# EAGLE design controller (EAGLE 7.4.0)
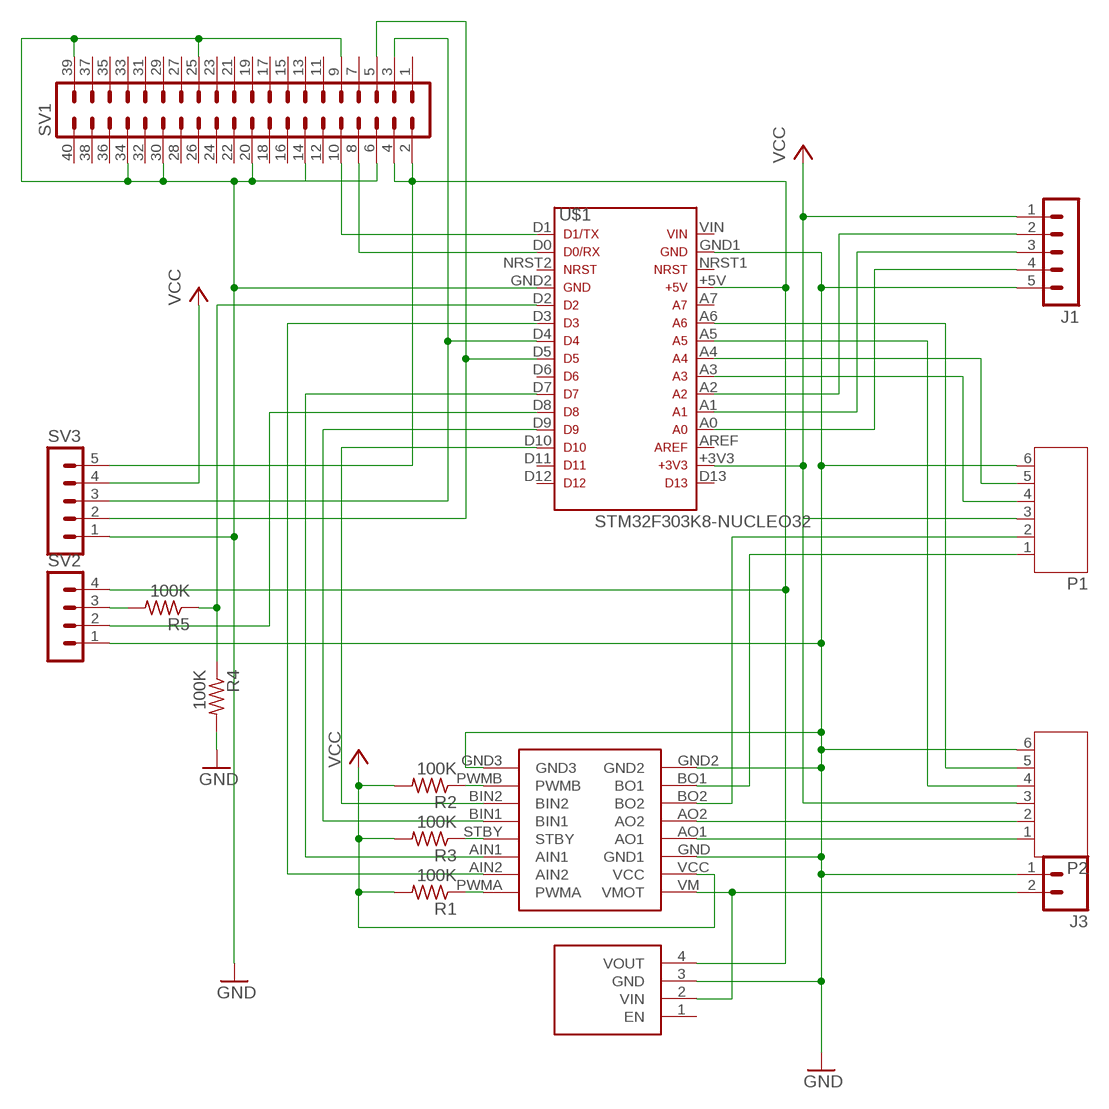
[diagram p0: schematic, sheet 1]

## Parts
J1  MA05-1  [MA05-1]
J3  M02JST-PTH-VERT  [JST-2-PTH-VERT]
P1  JST-PH6  [JST-PH6]
P2  JST-PH6  [JST-PH6]
R1  100K  R-US_M0805  [M0805]
R2  100K  R-US_M0805  [M0805]
R3  100K  R-US_M0805  [M0805]
R4  100K  R-US_M0805  [M0805]
R5  100K  R-US_M0805  [M0805]
SV1  MA20-2  [MA20-2]
SV2  MA04-1  [MA04-1]
SV3  MA05-1  [MA05-1]
U$1  STM32F303K8-NUCLEO32  [NUCLEO32]
U$2  TB6612FNG-CARRIER/SPARKFUN  [TB6612FNG-BRKOUT/SPARKFUN]
U$3  S7V8A  [S7V8]

## Nets
GND: J1.5 J3.1 P1.6 P2.6 R4.2 SV1.6 SV1.9 SV1.14 SV1.20 SV1.25 SV1.30 SV1.34 SV1.39 SV2.1 SV3.1 U$1.GND1 U$1.GND2 U$2.GND2 U$2.GND3 U$2.GND(GND1) U$3.3(GND)
N$1: U$1.D3 U$2.AIN2
N$2: U$1.D7 U$2.AIN1
N$3: U$1.D9 U$2.BIN1
N$4: U$1.D10 U$2.BIN2
N$5: P2.1 U$2.AO1
N$6: R2.1 U$2.PWMB
N$7: R1.1 U$2.PWMA
N$8: R3.1 U$2.STBY
N$9: P2.2 U$2.AO2
N$10: P1.2 U$2.BO2
N$11: P1.1 U$2.BO1
N$12: SV1.3 SV3.3 U$1.D4
N$13: SV1.5 SV3.2 U$1.D5
N$14: SV1.8 U$1.D0
N$15: SV1.10 U$1.D1
N$16: J3.2 U$2.VM(VMOT) U$3.2(VIN)
N$17: P1.5 U$1.A4
N$18: P1.4 U$1.A3
N$19: P2.5 U$1.A6
N$20: P2.4 U$1.A5
N$21: J1.2 U$1.A2
N$22: J1.3 U$1.A1
N$23: J1.4 U$1.A0
N$24: R5.2 SV2.3
N$25: SV1.2 SV1.4 SV2.4 SV3.5 U$1.+5V U$3.4(VOUT)
N$26: R4.1 R5.1 U$1.D2
N$27: SV2.2 U$1.D8
VCC: J1.1 P1.3 P2.3 R1.2 R2.2 R3.2 SV3.4 U$1.+3V3 U$2.VCC
Unconnected: SV1.1 SV1.7 SV1.11 SV1.12 SV1.13 SV1.15 SV1.16 SV1.17 SV1.18 SV1.19 SV1.21 SV1.22 SV1.23 SV1.24 SV1.26 SV1.27 SV1.28 SV1.29 SV1.31 SV1.32 SV1.33 SV1.35 SV1.36 SV1.37 SV1.38 SV1.40 U$1.A7 U$1.AREF U$1.D6 U$1.D11 U$1.D12 U$1.D13 U$1.NRST1 U$1.NRST2 U$1.VIN U$3.1(EN)

## Library data of the parts
J1 SV3 = con-lstb:MA05-1: PIN HEADER; OC_FARNELL: unknown; OC_NEWARK: unknown
J3 = SparkFun-Connectors:M02: Standard 2-pin 0.1" header. Use with - straight break away headers ( PRT-00116) - right angle break away headers (PRT-00553) - swiss pins (PRT-00743) - machine pins (PRT-00117) - female headers (PRT-00115) Molex polarized connector foot print use with: PRT-08233 with associated crimp pins and housings. 2.54_SCREWTERM for use with PRT-10571. 3.5mm Screw Terminal footprints for PRT-08084 5mm Screw Terminal footprints for use with PRT-08432
P1 P2 = jst-ph:JST-PH6
R1-R5 = adafruit:R-US_: RESISTOR, American symbol
SV1 = con-lstb:MA20-2: PIN HEADER; OC_FARNELL: unknown; OC_NEWARK: unknown
SV2 = con-lstb:MA04-1: PIN HEADER; OC_FARNELL: unknown; OC_NEWARK: unknown
U$1 = assorted:STM32F303K8-NUCLEO32
U$2 = assorted:TB6612FNG-CARRIER
U$3 = assorted:S7V8A

## Board
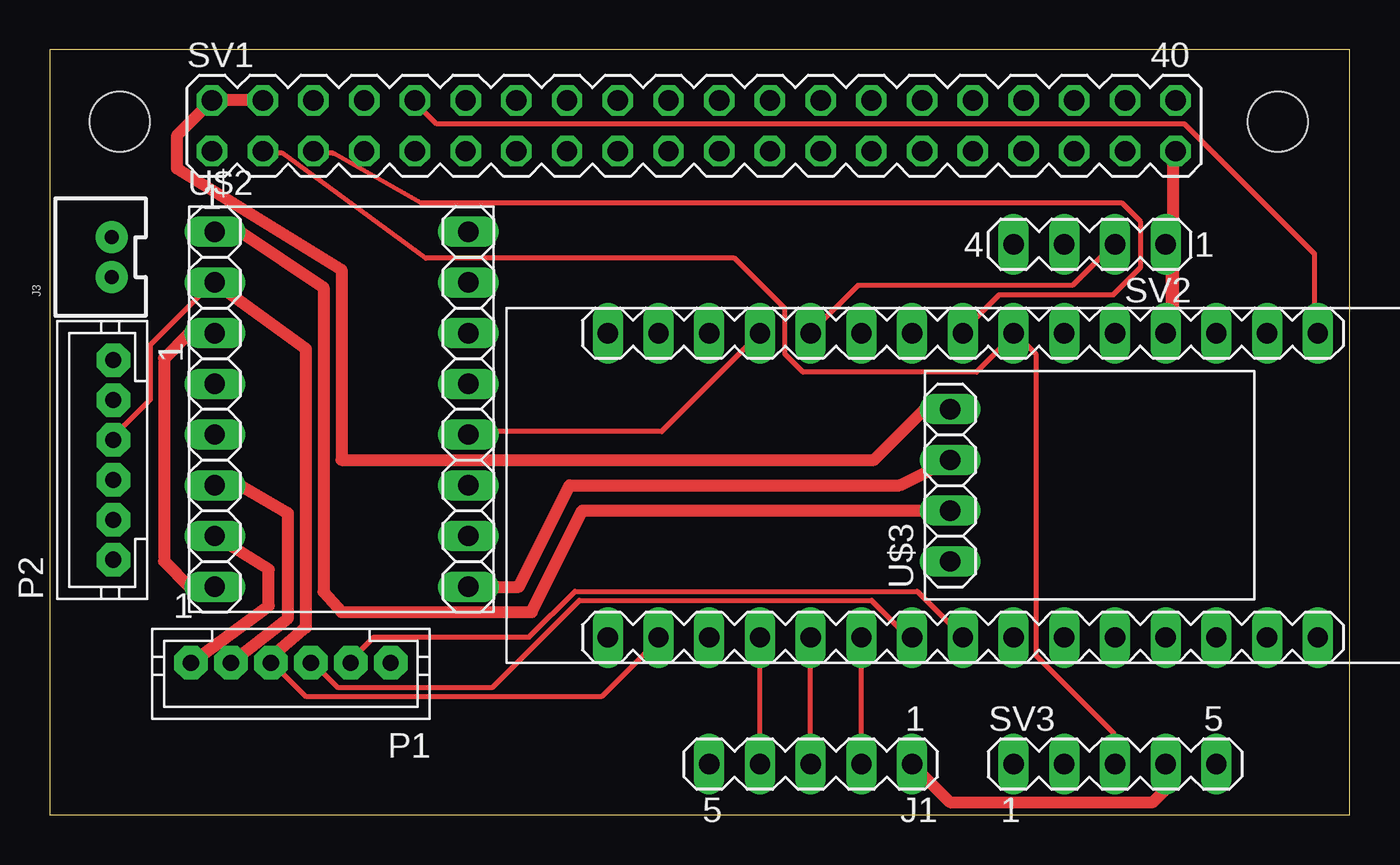
[diagram p1: board, top side]
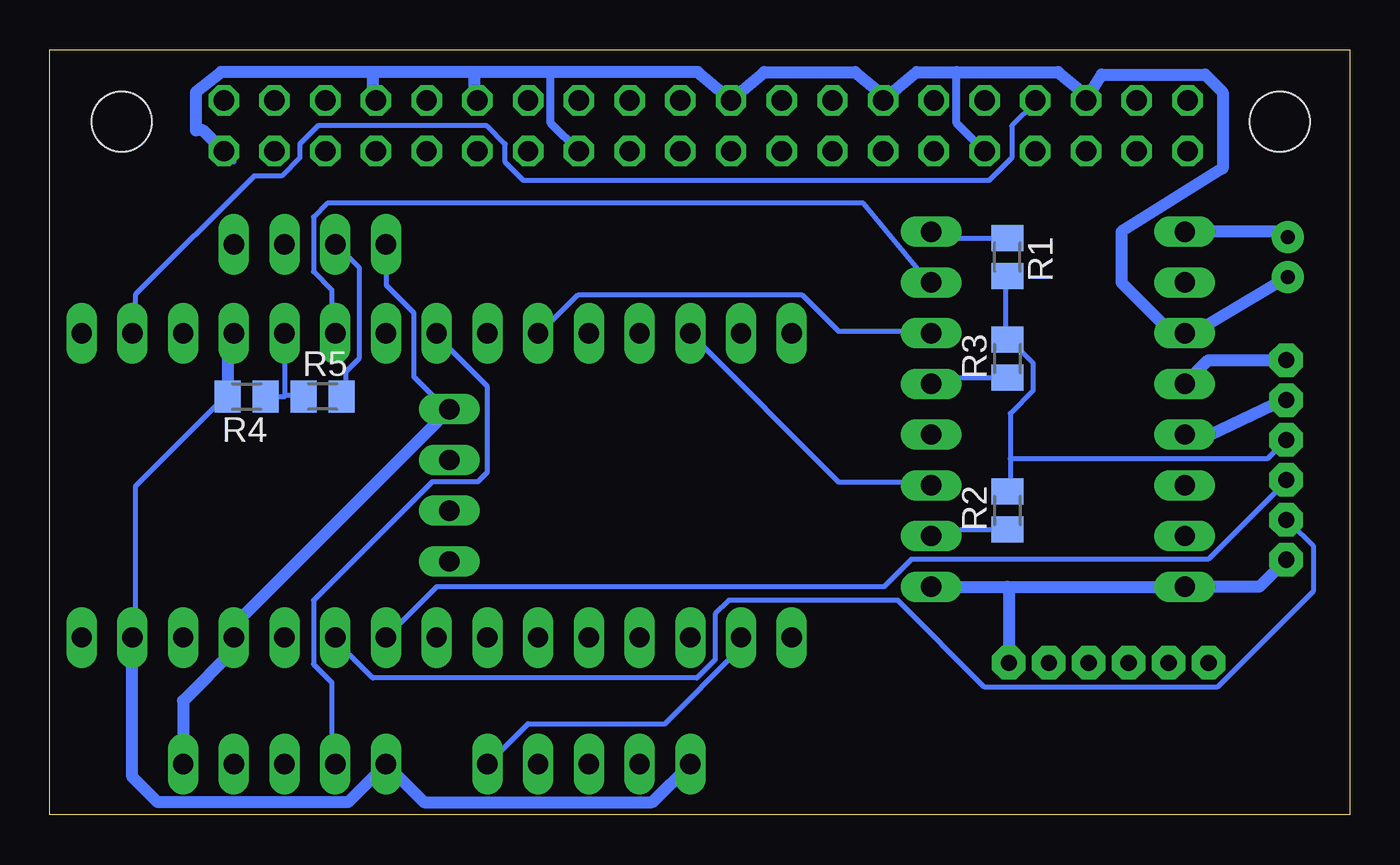
[diagram p2: board, bottom side, seen from below]

Size 65.09 x 38.32 mm. Coordinates in mm from the lower left corner, seen from the top.
Outline: 0,0 65.09,0 65.09,38.32 0,38.32 0,0
Copper layers (1*16): Top 0.035mm / dielectric 1.5mm / Bottom 0.035mm
Design rules "default": minimum track width 10mil, minimum drill 24mil, track to track 8mil, track to pad 8mil, pad to pad 8mil, via to via 8mil, smd to smd 8mil, copper to edge 40mil, drill to drill 8mil, minimum pad ring 10mil, minimum via ring 8mil, stop-mask expansion 4mil, vias tented up to drill 0mil, thermal gap 10mil
Holes 3 mm at 3.5,34.72 61.5,34.72

### Footprints (pad centres in the part's own frame; a part is rotated, then mirrored left to right if it is on the bottom)
MA05-1 = drill 1.016 long: 1 -5.08,0; 2 -2.54,0; 3 0,0; 4 2.54,0; 5 5.08,0
JST-2-PTH-VERT = drill 0.7 pad 1.6: 1 -1,-0.55; 2 1,-0.55
JST-PH6 = drill 0.813 pad 1.676 octagon: 1 5,0; 2 3,0; 3 1,0; 4 -1,0; 5 -3,0; 6 -5,0
M0805 = smd 1.3 x 1.6: 1 -0.95,0; 2 0.95,0
MA20-2 = drill 1.016 octagon: 1 -24.13,-1.27; 2 -24.13,1.27; 3 -21.59,-1.27; 4 -21.59,1.27; 5 -19.05,-1.27; 6 -19.05,1.27; 7 -16.51,-1.27; 8 -16.51,1.27; 9 -13.97,-1.27; 10 -13.97,1.27; 11 -11.43,-1.27; 12 -11.43,1.27; 13 -8.89,-1.27; 14 -8.89,1.27; 15 -6.35,-1.27; 16 -6.35,1.27; 17 -3.81,-1.27; 18 -3.81,1.27; 19 -1.27,-1.27; 20 -1.27,1.27; 21 1.27,-1.27; 22 1.27,1.27; 23 3.81,-1.27; 24 3.81,1.27; 25 6.35,-1.27; 26 6.35,1.27; 27 8.89,-1.27; 28 8.89,1.27; 29 11.43,-1.27; 30 11.43,1.27; 31 13.97,-1.27; 32 13.97,1.27; 33 16.51,-1.27; 34 16.51,1.27; 35 19.05,-1.27; 36 19.05,1.27; 37 21.59,-1.27; 38 21.59,1.27; 39 24.13,-1.27; 40 24.13,1.27
MA04-1 = drill 1.016 long: 1 -3.81,0; 2 -1.27,0; 3 1.27,0; 4 3.81,0
NUCLEO32 = drill 1.016 long: +3V3 7.62,-15.24; +5V 7.62,10.16; A0 7.62,-10.16; A1 7.62,-7.62; A2 7.62,-5.08; A3 7.62,-2.54; A4 7.62,0; A5 7.62,2.54; A6 7.62,5.08; A7 7.62,7.62; AREF 7.62,-12.7; D0 -7.62,15.24; D1 -7.62,17.78; D2 -7.62,7.62; D3 -7.62,5.08; D4 -7.62,2.54; D5 -7.62,0; D6 -7.62,-2.54; D7 -7.62,-5.08; D8 -7.62,-7.62; D9 -7.62,-10.16; D10 -7.62,-12.7; D11 -7.62,-15.24; D12 -7.62,-17.78; D13 7.62,-17.78; GND1 7.62,15.24; GND2 -7.62,10.16; NRST1 7.62,12.7; NRST2 -7.62,12.7; VIN 7.62,17.78
TB6612FNG-BRKOUT/SPARKFUN = drill 1.016 long: AIN1 6.35,3.81; AIN2 6.35,6.35; AO1 -6.35,1.27; AO2 -6.35,-1.27; BIN1 6.35,-1.27; BIN2 6.35,-3.81; BO1 -6.35,-6.35; BO2 -6.35,-3.81; GND -6.35,3.81; GND2 -6.35,-8.89; GND3 6.35,-8.89; PWMA 6.35,8.89; PWMB 6.35,-6.35; STBY 6.35,1.27; VCC -6.35,6.35; VM -6.35,8.89
S7V8 = drill 1.016 long: 1 -3.81,0; 2 -1.27,0; 3 1.27,0; 4 3.81,0

### Placement (x,y rotation side)
J1  38.1,2.54 180 top
J3  2.54,27.94 90 top
P1  12.06,7.62 180 top
P2  3.17,17.78 90 top
R1  17.14,27.94 270 bottom
R2  17.14,15.24 90 bottom
R3  17.14,22.86 90 bottom
R4  55.24,20.95 180 bottom
R5  51.44,20.95 0 bottom
SV1  32.25,34.52 0 top
SV2  52.07,28.57 180 top
SV3  53.34,2.54 0 top
U$1  45.72,16.51 270 top
U$2  14.61,20.32 0 top
U$3  45.09,16.51 90 top

### Tracks (layer width: path | path; a pad name or v marks a point on that pad's centre or on a via)
GND
  Top 0.254: 56.01,24.23 56.01,28.57 SV2.1 | 56.24,24.46 56.01,24.23 | 56.01,24.23 U$1.GND2 | 56.24,33.15 SV1.39
  Top 0.61: U$2.GND3 23.5,11.43 26.04,16.51 42.55,16.51 U$3.3 | 56.24,33.15 56.24,24.46 | U$2.GND 6.99,24.13 5.71,22.86 5.71,12.7 6.99,11.43 U$2.GND2
  Bottom 0.254: 55.88,32.7 56.2,33.02 SV1.39 | U$1.GND1 60.81,9.14 60.81,16.46 56.46,20.8 R4.2
  Bottom 0.406: SV1.25 40.01,34.66 40.01,37.22 | SV1.9 19.68,34.66 19.68,37.22
  Bottom 0.61: U$1.GND2 56.2,23.82 R4.2 | 43.81,37.22 40.01,37.22 32.66,37.22 SV1.20 29.3,37.22 24.77,37.22 23.36,36.06 SV1.14 21.68,37.22 19.68,37.22 14.61,37.22 13.2,36.06 SV1.6 12.41,37.08 7.24,37.08 6.35,36.2 6.35,32.38 11.43,29.21 11.43,26.67 8.89,24.13 U$2.GND 7.8,24.13 J3.1 | 43.81,37.22 48.9,37.22 | 48.9,37.22 56.52,37.22 57.78,36.2 57.78,34.29 57.42,34.29 SV1.39 | SV1.30 43.81,35.92 43.81,37.22 | SV1.34 48.9,35.92 48.9,37.22 | U$2.GND3 17.14,11.43 | 17.14,11.43 U$2.GND2 4.53,11.43 P2.6 | J1.5 34.92,0.64 46.35,0.64 SV3.1 50.16,0.64 59.69,0.64 60.96,1.91 U$1.GND1 | 17.14,11.43 17.07,11.35 P1.6
N$1
  Bottom 0.254: U$1.D3 50.98,24.23 50.98,26.29 51.89,27.2 51.89,29.95 51.21,30.63 24.36,30.63 21.11,26.75 U$2.AIN2
N$2
  Bottom 0.254: U$2.AIN1 21.11,24.23 25.6,24.23 27.43,26.06 38.63,26.06 40.46,24.23 U$1.D7
N$3
  Top 0.254: U$1.D9 30.63,19.2 21.11,19.2 U$2.BIN1
N$4
  Bottom 0.254: U$2.BIN2 21.11,16.69 25.6,16.69 32.92,24 U$1.D10
N$5
  Bottom 0.61: U$2.AO1 7.07,22.78 P2.1
N$6
  Bottom 0.254: U$2.PWMB 20.64,14.29 R2.1
N$7
  Bottom 0.254: U$2.PWMA 20.64,28.89 R1.1
N$8
  Bottom 0.254: U$2.STBY 20.64,21.91 R3.1
N$9
  Bottom 0.61: U$2.AO2 6.99,19.05 3.35,20.78 P2.2
N$10
  Top 0.61: P1.2 11.93,9.85 11.93,15.11 9.53,16.51 U$2.BO2
N$11
  Top 0.61: P1.1 10.96,10.47 10.96,12.29 U$2.BO1
N$12
  Top 0.254: SV3.3 53.26,2.74 53.26,4.12 49.38,8 49.38,23.09 48.46,24 U$1.D4 48.23,24 46.41,22.17 37.72,22.17 36.8,23.09 36.8,25.38 34.29,27.89 18.82,27.89 11.66,33.15 10.74,33.15 SV1.3
N$13
  Top 0.254: SV1.5 13.26,33.15 14.17,33.15 18.59,30.63 53.72,30.63 54.63,29.72 54.63,27.43 53.26,26.06 47.55,26.06 45.72,24.23 U$1.D5
  Bottom 0.254: SV3.2 50.98,2.74 50.98,6.63 51.89,7.54 51.89,10.74 45.95,16.69 43.66,16.69 43.2,17.14 43.2,21.49 45.72,24 U$1.D5
N$14
  Top 0.254: 15.88,35.56 SV1.8
  Bottom 0.254: U$1.D0 60.81,24.23 60.81,26.06 54.86,32 53.49,32 52.58,32.92 52.58,33.6 51.66,34.52 43.2,34.52 42.29,33.6 42.29,32.69 41.38,31.77 18.06,31.77 16.92,32.92 16.92,34.52 15.77,35.66 SV1.8
N$15
  Top 0.254: SV1.10 18.41,35.56 19.37,34.61 56.83,34.61 63.32,28.12 63.32,24.23 U$1.D1
N$16
  Top 0.61: U$2.VM 9.53,29.21 13.7,26.42 13.7,11.18 14.61,10.16 24.13,10.16 26.67,15.24 U$3.2
  Bottom 0.61: J3.2 3.36,29.21 U$2.VM
N$17
  Top 0.254: U$1.A4 45.72,8.91 43.43,11.2 26.29,11.2 24,8.91 16.23,8.91 15.09,7.77 P1.5
N$18
  Top 0.254: U$1.A3 42.98,8.91 41.15,10.74 26.52,10.74 22.17,6.4 14.4,6.4 13.26,7.54 P1.4
N$19
  Bottom 0.254: U$1.A6 50.75,8.69 48.92,6.86 32.69,6.86 31.77,7.77 31.77,10.06 31.09,10.74 22.63,10.74 18.29,6.4 6.63,6.4 1.83,11.2 1.83,13.49 2.97,14.63 P2.5
N$20
  Bottom 0.254: U$1.A5 45.72,11.43 23.32,11.43 21.95,12.8 7.09,12.8 3.2,16.69 P2.4
N$21
  Top 0.254: J1.2 U$1.A2
N$22
  Top 0.254: J1.3 U$1.A1
N$23
  Top 0.254: J1.4 U$1.A0
N$24
  Bottom 0.254: R5.2 50.29,21.03 50.29,22.17 49.61,22.86 49.61,27.43 50.75,28.57 SV2.3
N$25
  Top 0.61: U$3.4 43.81,20.32 41.27,17.78 14.61,17.78 14.61,27.3 6.35,32.38 6.35,34.02 SV1.2 SV1.4
  Bottom 0.254: SV2.4 48.23,28.57 48.23,26.52 46.86,25.15 46.86,21.95 45.26,20.34 U$3.4 45.26,20.12 | 55.78,9.14 U$1.+5V
  Bottom 0.61: U$1.+5V 55.88,8.26 58.42,5.71 SV3.5 | 45.26,20.12 55.78,9.6 55.78,9.14
N$26
  Bottom 0.254: R4.1 53.34,20.95 53.34,21.03 | U$1.D2 53.34,21.03 | 53.34,21.03 52.58,21.03 R5.1
N$27
  Top 0.254: U$1.D8 38.18,24.23 40.46,26.52 51.21,26.52 53.26,28.57 SV2.2
VCC
  Top 0.254: P2.3 3.2,18.97 5.03,20.8 5.03,23.55 8,26.52 U$2.VCC | U$1.+3V3 30.4,8.69 27.66,5.94 12.8,5.94 11.2,7.54 P1.3
  Top 0.61: J1.1 45.09,0.64 55.24,0.64 55.88,1.27 SV3.4 | U$2.VCC 12.81,23.36 12.81,9.39 11.06,7.89 P1.3
  Bottom 0.254: 16.99,17.83 16.99,20.12 15.85,21.26 15.85,22.63 16.99,23.77 R3.2 17.22,24 17.22,26.98 R1.2 | 16.99,17.83 16.99,16.23 R2.2 | 16.99,17.83 4.12,17.83 3.2,18.75 P2.3 | 30.4,8.69 U$1.+3V3 30.63,8.69 30.63,8.23 34.29,4.57 41.15,4.57 J1.1 | 11.2,7.54 P1.3